# Altium schematic sheet 11_Fan.SchDoc
size A4; Organization: OLTEST; Revision: 01; SheetNumber: 11; SheetTotal: 13; Название листа: Название листа; Разработчик: Бондарчук С.; Прибор: R100; АМАК.000000.000 Э3: R100.230.030.000-00; Дата: 16.04.2019; Формат: A4; workspacename: R100_Boards_v1
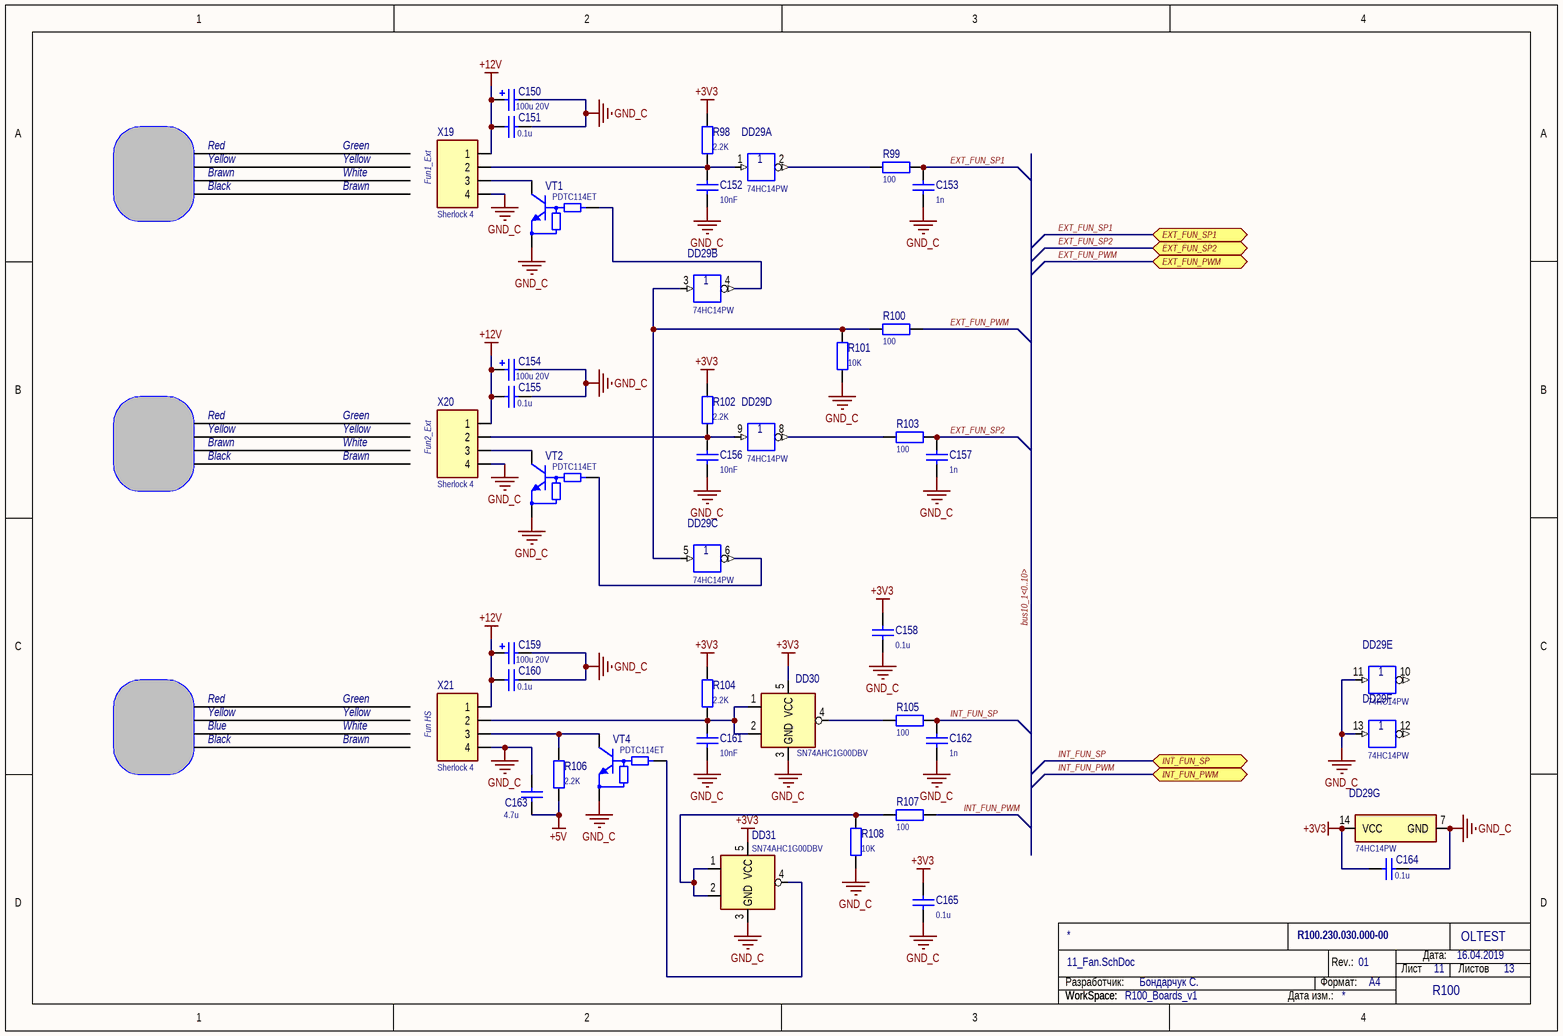
[diagram p0: 11_Fan.SchDoc]

## Parts
C150  100u 20V  [TAJD]
C151  0.1u  [SMD_C_0603]
C152  10nF  [SMD_C_0603]
C153  1n  [SMD_C_0603]
C154  100u 20V  [TAJD]
C155  0.1u  [SMD_C_0603]
C156  10nF  [SMD_C_0603]
C157  1n  [SMD_C_0603]
C158  0.1u  [SMD_C_0603]
C159  100u 20V  [TAJD]
C160  0.1u  [SMD_C_0603]
C161  10nF  [SMD_C_0603]
C162  1n  [SMD_C_0603]
C163  4.7u  [SMD_C_0805]
C164  0.1u  [SMD_C_0603]
C165  0.1u  [SMD_C_0603]
DD29  74HC14PW  [TSSOP14]  (parts A,B,C,D,E,F,G of 7)
DD30  SN74AHC1G00DBV  [SOT-23(DBV)]
DD31  SN74AHC1G00DBV  [SOT-23(DBV)]
R98  2.2K  [SMD_R_0603]
R99  100  [SMD_R_0603]
R100  100  [SMD_R_0603]
R101  10K  [SMD_R_0603]
R102  2.2K  [SMD_R_0603]
R103  100  [SMD_R_0603]
R104  2.2K  [SMD_R_0603]
R105  100  [SMD_R_0603]
R106  2.2K  [SMD_R_0603]
R107  100  [SMD_R_0603]
R108  10K  [SMD_R_0603]
VT1  PDTC114ET  [SOT23-3]
VT2  PDTC114ET  [SOT23-3]
VT4  PDTC114ET  [SOT23-3]
X19  Sherlock 4  [35362-0450]
X20  Sherlock 4  [35362-0450]
X21  Sherlock 4  [35362-0450]

## Ports
EXT_FUN_PWM, EXT_FUN_SP1, EXT_FUN_SP2, INT_FUN_PWM, INT_FUN_SP

## Nets
+3V3: C158.2 C164.1 C165.2 DD29.14(VCC) DD30.5(VCC) DD31.5(VCC) R98.2 R102.2 R104.2
+5V: C163.1 R106.1
+12V: C150.1 C151.1 C154.1 C155.1 C159.1 C160.1 X19.1 X20.1 X21.1
GND_C: C150.2 C151.2 C152.2 C153.1 C154.2 C155.2 C156.2 C157.1 C158.1 C159.2 C160.2 C161.2 C162.1 C163.2 C164.2 C165.1 DD29.7(GND) DD29.11(5A) DD29.13(6A) DD30.3(GND) DD31.3(GND) R101.1 R108.1 VT1.2(E) VT2.2(E) VT4.2(E) X19.4 X20.4 X21.4
EXT_FUN_PWM: R100.2 ; port EXT_FUN_PWM
EXT_FUN_SP1: C153.2 R99.2 ; port EXT_FUN_SP1
EXT_FUN_SP2: C157.2 R103.2 ; port EXT_FUN_SP2
INT_FUN_PWM: R107.2 ; port INT_FUN_PWM
INT_FUN_SP: C162.2 R105.2 ; port INT_FUN_SP
NetC152_1: C152.1 DD29.1(1A) R98.1 X19.2
NetC156_1: C156.1 DD29.9(4A) R102.1 X20.2
NetC161_1: C161.1 DD30.1 DD30.2 R104.1 X21.2
NetDD29_2: DD29.2(1Y) R99.1
NetDD29_3: DD29.3(2A) DD29.5(3A) R100.1 R101.2
NetDD29_4: DD29.4(2Y) VT1.1(B)
NetDD29_6: DD29.6(3Y) VT2.1(B)
NetDD29_8: DD29.8(4Y) R103.1
NetDD30_4: DD30.4 R105.1
NetDD31_1: DD31.1 DD31.2 R107.1 R108.2
NetDD31_4: DD31.4 VT4.1(B)
NetR106_2: R106.2 VT4.3(C) X21.3
NetVT1_3: VT1.3(C) X19.3
NetVT2_3: VT2.3(C) X20.3

Not connected (* = marked no-connect by the designer): DD29 10(5Y) 12(6Y)

## Buses and harness runs
bus bus10_1<0..10>

## Notes on the sheet
- Red
- Yellow
- Brawn
- Green
- White
- (near X19) Fun1_Ext
- Black
- (near X20) Fun2_Ext
- Blue
- (near X21) Fun HS
- Разработчик:
- Формат:
- Rev.:
- Лист
- Дата:
- Листов
- WorkSpace:
- Дата изм.:
- (in symbol SN74AHC1G00DBV) &

## Library data of the parts
C150 C154 C159 = TECAP 100u 20V 10%: SMD SIZE D TANTALUM AVX 20V 10%; PartNumber: TAJD107K020RNJ; Manufacturer: AVX; Value: 100u 20V
C151 C155 C158 C160 C164 C165 = C0603 0.1u 50V 10%: SMD C 0603 MURATA 50V 10% X7R; PartNumber: GRM188R71H104K; Manufacturer: MURATA; Value: 0.1u
C152 C156 C161 = C0603 10nF 100V 10%: SMD C 0603 MURATA 100V 10% X7R; PartNumber: GRJ188R72A103KE11#; Manufacturer: MURATA; Value: 10nF
C153 C157 C162 = C0603 1n 50V 5%: SMD C 0603 MURATA 50V 5% NP0; PartNumber: GRM1885C1H102JA01; Manufacturer: MURATA; Value: 1n
C163 = C0805 4.7u 25V 20%  X5R: SMD C 0805 MURATA 50V 5% NP0; PartNumber: GRM21BR61E475M; Manufacturer: MURATA; Value: 4.7u
DD29 = 74HC14: Quadruple 2-Input Positive-OR Gates, PW0014A; Manufacturer: Texas Instruments; PackageReference: PW0014A; PartNumber: 74HC14PW
DD30 DD31 = SN74AHC1G00DBV: 2-in NAND; Manufacturer: Texas Instruments; PartNumber: SN74AHC1G00DBV
R98 R102 R104 R106 = R0603 2.2K 1%: SMD R 0603 VISHAY 0.1W 75V 1% 100ppm; PartNumber: CRCW06032K20FK; Manufacturer: VISHAY; Value: 2.2K
R99 R100 R103 R105 R107 = R0603 100 1%: SMD R 0603 VISHAY 0.1W 75V 1% 100ppm; PartNumber: CRCW0603100RFK; Manufacturer: VISHAY; Value: 100
R101 R108 = R0603 10К 1%: SMD R 0603 VISHAY 0.1W 75V 1% 100ppm; PartNumber: CRCW060310K0FK; Manufacturer: VISHAY; Value: 10K
VT1 VT2 VT4 = PDTC114ET: Digital Transistor (BRT), R1=10 kOhm, R2=10 kOhm, NPN Transistor; Manufacturer: On Semiconductor; PartNumber: PDTC114ET
X19-X21 = 35362-0450: Sherlock 4 Top, 2A 125V 2mm; Manufacturer: MOLEX; PartNumber: 35362-0450